# Altium schematic sheet Motorcontroller.SchDoc
size A4; SheetNumber: 1; SheetTotal: 2
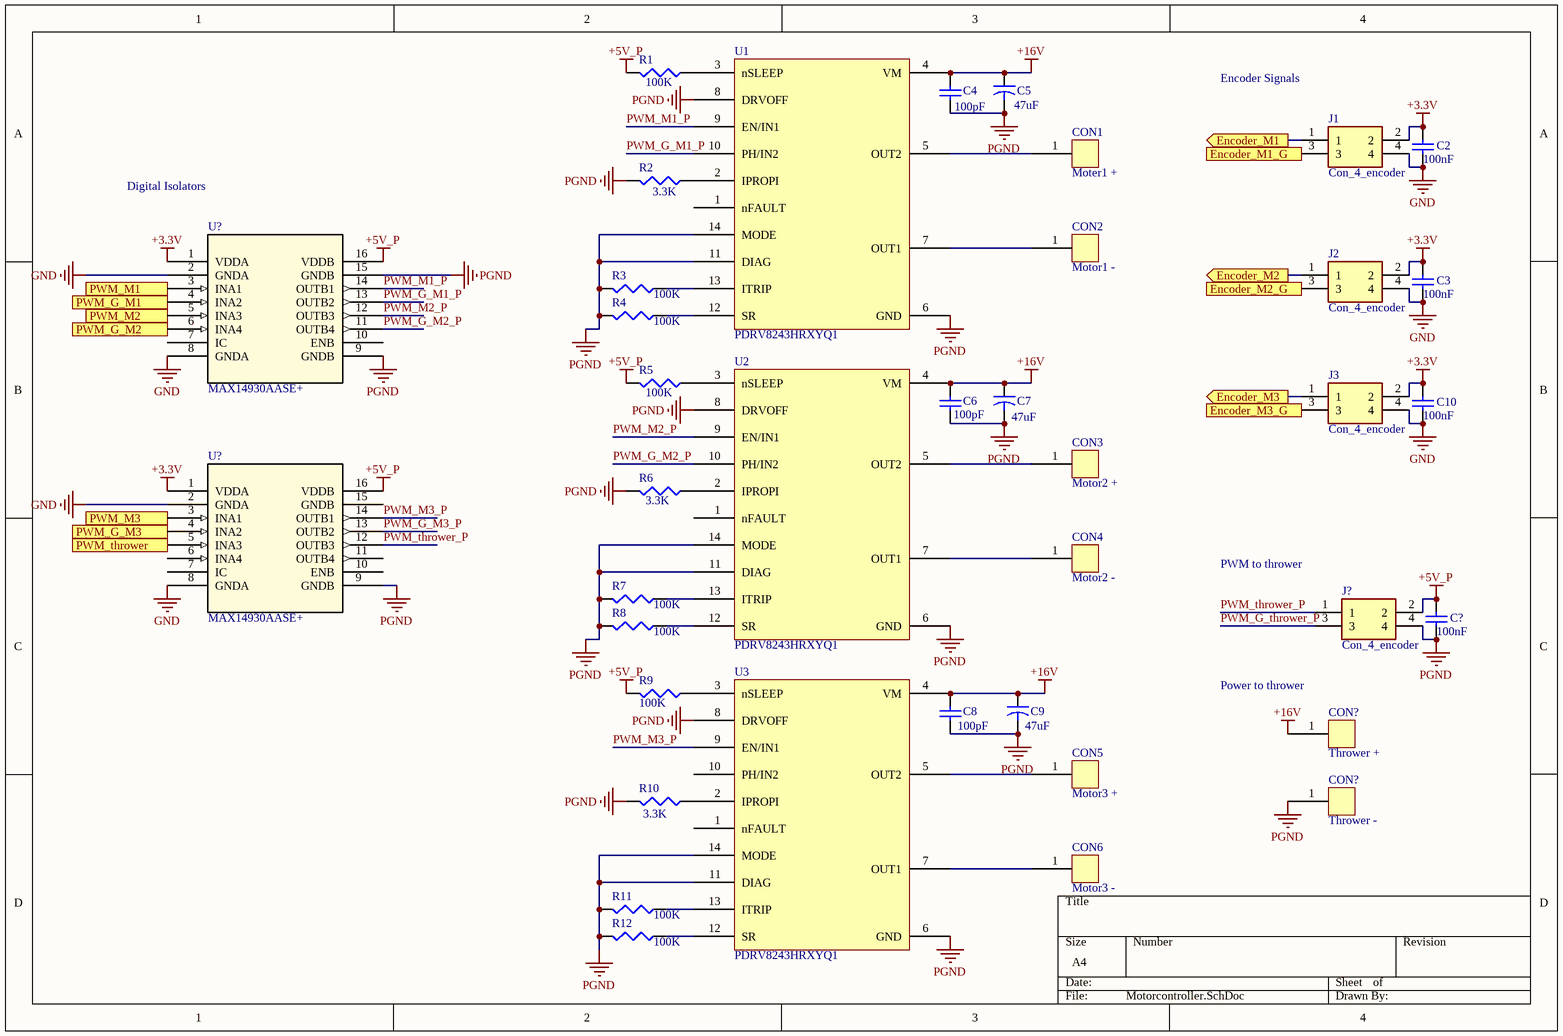
[diagram p0: Motorcontroller.SchDoc]

## Parts
(Parts that share a designator on the sheet are numbered #1, #2 ... from top to bottom, then left to right.)
C2  value 100nF  [C1206]  (hidden comment: Cap Semi)
C3  value 100nF  [C1206]  (hidden comment: Cap Semi)
C4  value 100pF  [C1206]  (hidden comment: Cap Semi)
C5  value 47uF  [CAPR5-4X5]  (hidden comment: Cap2)
C6  value 100pF  [C1206]  (hidden comment: Cap Semi)
C7  value 47uF  [CAPR5-4X5]  (hidden comment: Cap2)
C8  value 100pF  [C1206]  (hidden comment: Cap Semi)
C9  value 47uF  [CAPR5-4X5]  (hidden comment: Cap2)
C10  value 100nF  [C1206]  (hidden comment: Cap Semi)
C?  value 100nF  [C1206]  (hidden comment: Cap Semi)
CON1  Moter1 +  [con_soldering]
CON2  Motor1 -  [con_soldering]
CON3  Motor2 +  [con_soldering]
CON4  Motor2 -  [con_soldering]
CON5  Motor3 +  [con_soldering]
CON6  Motor3 -  [con_soldering]
CON?#1  Thrower +  [con_soldering]
CON?#2  Thrower -  [con_soldering]
J1  Con_4_encoder  [TE_7-215079-4]
J2  Con_4_encoder  [TE_7-215079-4]
J3  Con_4_encoder  [TE_7-215079-4]
J?  Con_4_encoder  [TE_7-215079-4]
R1  value 100K  [J1-0603]
R2  value 3.3K  [J1-0603]
R3  value 100K  [J1-0603]
R4  value 100K  [J1-0603]
R5  value 100K  [J1-0603]
R6  value 3.3K  [J1-0603]
R7  value 100K  [J1-0603]
R8  value 100K  [J1-0603]
R9  value 100K  [J1-0603]
R10  value 3.3K  [J1-0603]
R11  value 100K  [J1-0603]
R12  value 100K  [J1-0603]
U1  PDRV8243HRXYQ1  [DRV8243_motor_driver]
U2  PDRV8243HRXYQ1  [DRV8243_motor_driver]
U3  PDRV8243HRXYQ1  [DRV8243_motor_driver]
U?#1  MAX14930AASE+  [21-0041_S16+1_MXM]
U?#2  MAX14930AASE+  [21-0041_S16+1_MXM]

## Ports
Encoder_M1 (out), Encoder_M1_G (out), Encoder_M2 (out), Encoder_M2_G (out), Encoder_M3 (out), Encoder_M3_G (out), PWM_G_M1 (in), PWM_G_M2 (in), PWM_G_M3 (in), PWM_M1 (in), PWM_M2 (in), PWM_M3 (in), PWM_thrower (in)

## Nets
+3.3V: C2.2 C3.2 C10.2 J1.2 J2.2 J3.2 U?#1.1(VDDA) U?#2.1(VDDA)
+5V_P: C?.2 J?.2 R1.2 R5.2 R9.2 U?#1.16(VDDB) U?#2.16(VDDB)
+16V: C4.2 C5.1 C6.2 C7.1 C8.2 C9.1 CON?#1.1 U1.4(VM) U2.4(VM) U3.4(VM)
GND: C2.1 C3.1 C10.1 J1.4 J2.4 J3.4 U?#1.2(GNDA) U?#1.8(GNDA) U?#2.2(GNDA) U?#2.8(GNDA)
PGND: C4.1 C5.2 C6.1 C7.2 C8.1 C9.2 C?.1 CON?#2.1 J?.4 R2.2 R3.2 R4.2 R6.2 R7.2 R8.2 R10.2 R11.2 R12.2 U1.6(GND) U1.8(DRVOFF) U1.11(DIAG) U1.14(MODE) U2.6(GND) U2.8(DRVOFF) U2.11(DIAG) U2.14(MODE) U3.6(GND) U3.8(DRVOFF) U3.11(DIAG) U3.14(MODE) U?#1.9(GNDB) U?#1.15(GNDB) U?#2.9(GNDB)
Encoder_M1: J1.1 ; port Encoder_M1
Encoder_M1_G: J1.3 ; port Encoder_M1_G
Encoder_M2: J2.1 ; port Encoder_M2
Encoder_M2_G: J2.3 ; port Encoder_M2_G
Encoder_M3: J3.1 ; port Encoder_M3
Encoder_M3_G: J3.3 ; port Encoder_M3_G
PWM_G_M1: U?#1.4(INA2) ; port PWM_G_M1
PWM_G_M1_P: U1.10(PH/IN2) U?#1.13(OUTB2)
PWM_G_M2: U?#1.6(INA4) ; port PWM_G_M2
PWM_G_M2_P: U2.10(PH/IN2) U?#1.11(OUTB4)
PWM_G_M3: U?#2.4(INA2) ; port PWM_G_M3
PWM_G_M3_P: U?#2.13(OUTB2)
PWM_G_thrower_P: J?.3
PWM_M1: U?#1.3(INA1) ; port PWM_M1
PWM_M1_P: U1.9(EN/IN1) U?#1.14(OUTB1)
PWM_M2: U?#1.5(INA3) ; port PWM_M2
PWM_M2_P: U2.9(EN/IN1) U?#1.12(OUTB3)
PWM_M3: U?#2.3(INA1) ; port PWM_M3
PWM_M3_P: U3.9(EN/IN1) U?#2.14(OUTB1)
PWM_thrower: U?#2.5(INA3) ; port PWM_thrower
PWM_thrower_P: J?.1 U?#2.12(OUTB3)
NetCON1_1: CON1.1 U1.5(OUT2)
NetCON2_1: CON2.1 U1.7(OUT1)
NetCON3_1: CON3.1 U2.5(OUT2)
NetCON4_1: CON4.1 U2.7(OUT1)
NetCON5_1: CON5.1 U3.5(OUT2)
NetCON6_1: CON6.1 U3.7(OUT1)
NetR1_1: R1.1 U1.3(nSLEEP)
NetR2_1: R2.1 U1.2(IPROPI)
NetR3_1: R3.1 U1.13(ITRIP)
NetR4_1: R4.1 U1.12(SR)
NetR5_1: R5.1 U2.3(nSLEEP)
NetR6_1: R6.1 U2.2(IPROPI)
NetR7_1: R7.1 U2.13(ITRIP)
NetR8_1: R8.1 U2.12(SR)
NetR9_1: R9.1 U3.3(nSLEEP)
NetR10_1: R10.1 U3.2(IPROPI)
NetR11_1: R11.1 U3.13(ITRIP)
NetR12_1: R12.1 U3.12(SR)

Not connected (* = marked no-connect by the designer): U1 1(nFAULT); U2 1(nFAULT); U3 1(nFAULT) 10(PH/IN2); U?#1 7(IC) 10(ENB); U?#2 6(INA4) 7(IC) 10(ENB) 11(OUTB4) 15(GNDB)

## Notes on the sheet
- Encoder Signals
- Digital Isolators
- PWM to thrower
- Power to thrower

## Library data of the parts
C2-C4 C6 C8 C10 C? = Cap Semi: Capacitor (Semiconductor SIM Model); Published: 8-Jun-2000; LatestRevisionDate: 29-May-2009; LatestRevisionNote: IPC-7351 Footprint Added.; PackageReference: C1206; Publisher: Altium Limited; PackageDescription: Chip Capacitor
C5 C7 C9 = Cap2: Capacitor; Published: 23-Sep-2002; PackageReference: CAPR5-4X5; Publisher: Altium Limited; PackageDescription: Capacitor; 2 Leads
CON1-CON6 CON?#1 CON?#2 = Con_soldering
J1-J3 J? = Con_4_encoder: Micro-MaTch 4 Position 1.27 mm Pitch Vertical Female-on-Board Connector; MP: 7-215079-4; MF: TE Connectivity; Value: *; SnapEDA_Link: https://www.snapeda.com/parts/7-215079-4/TE%20Connectivity%20AMP%20Connectors/view-part/453401/?ref=snap; Price: None; Package: SMD-6; Availability: Unavailable
R1-R12 = Res3: Resistor; Published: 8-Jun-2000; LatestRevisionDate: 29-May-2009; LatestRevisionNote: IPC-7351 Footprint Added.; PackageReference: J1-0603; Publisher: Altium Limited; PackageDescription: Chip Resistor
U?#1 U?#2 = MAX14930AASE+: No Description Available; Mfr_Name: Maxim Integrated Products; Copyright: Copyright (C) 2021 Ultra Librarian. All rights reserved.; Manufacturer_Part_Number: MAX14930AASE+; RefDes: RefDes; Type: DEV